# EAGLE board PLC_YN_CPU (EAGLE 9.6.2), part 1 of 2
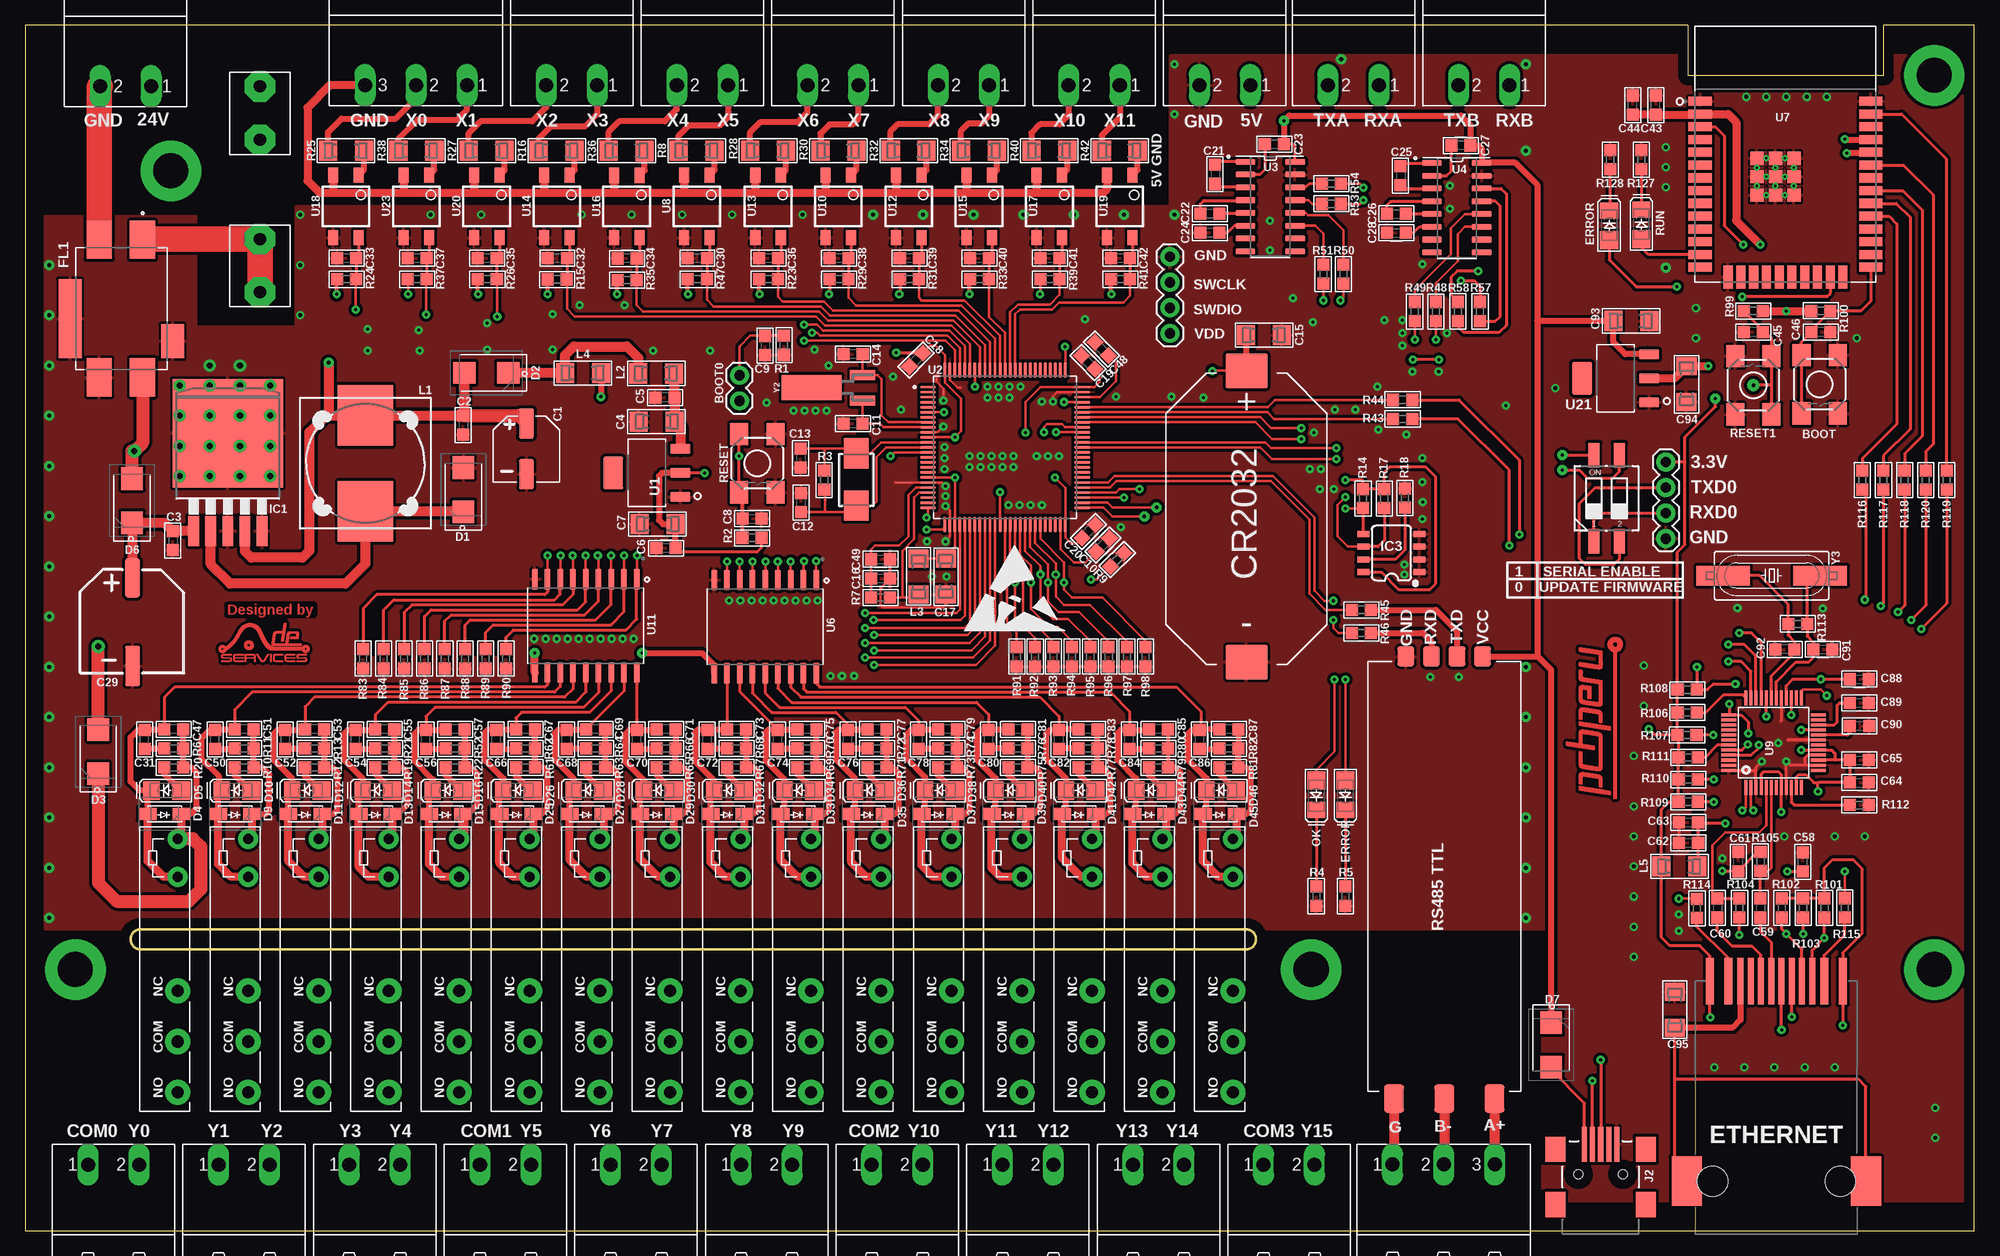
[diagram p8: board, top side]
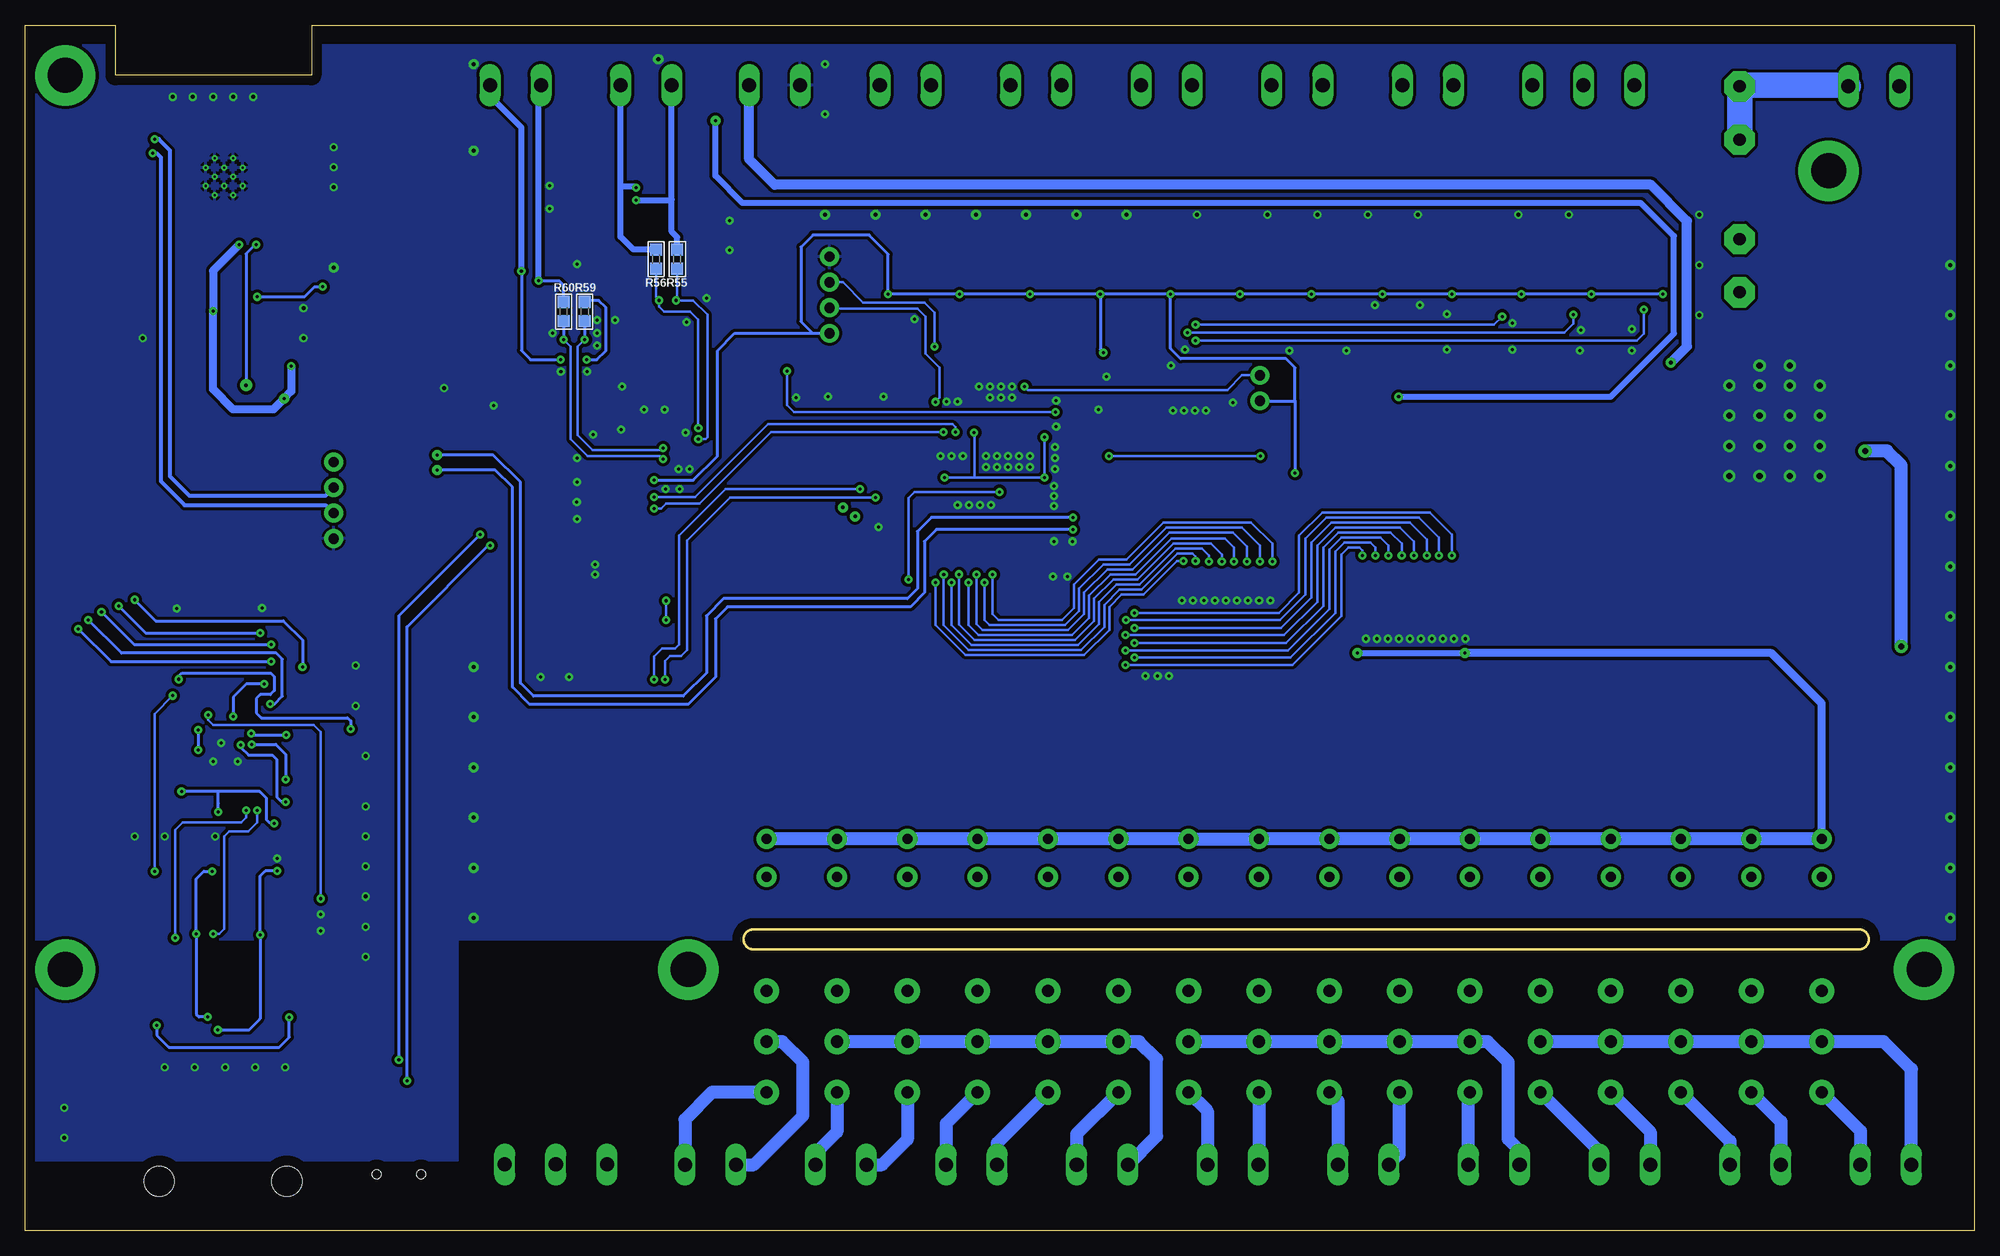
[diagram p9: board, bottom side, seen from below]

Size 194 x 120 mm. Coordinates in mm from the lower left corner, seen from the top.
Outline: 0,0 194,0 194,120 185,120 185,115 165.5,115 165.5,120 0,120 0,0
Outline: 11.5,30 arc90 10.5,29 arc90 11.5,28 121.5,28 arc90 122.5,29 arc90 121.5,30 11.5,30
Copper layers (1*16): Top 0.035mm / dielectric 1.6mm / Bottom 0.035mm
Design rules "Configuración_PCB_ADE *": minimum track width 0.2mm, minimum drill 0.3mm, track to track 0.125mm, track to pad 0.125mm, pad to pad 0.125mm, via to via 0.3mm, smd to smd 0.3mm, copper to edge 1mm, drill to drill 0.3mm, minimum pad ring 0.2mm, minimum via ring 0.125mm, stop-mask expansion 0.15mm, vias tented up to drill 0.3mm, thermal gap 10mil

## Footprints (pad centres in the part's own frame; a part is rotated, then mirrored left to right if it is on the bottom)
SWITCH = smd 2.2 x 1.8: 1 -2.894,1.805; 2 2.894,1.805; 3 -2.894,-1.805; 4 2.894,-1.805
1X02 = drill 1.016 pad 1.88: 1 0,0; 2 2.54,0
BAT_CR2032_SMD = smd 4.2 x 3.5: N 0,-13.76; P 0,15.24
CAP_100UF_6.3X7.7SMD = smd 1.5 x 3: N 0,-2.7; P 0,2.35
C0603 = smd 1.2 x 1.2: 1 -0.95,0; 2 0.95,0
SMD_1206 = smd 1.8 x 2: 1 -1.75,0.01; 2 1.83,0
CAP_470UF_SMD_10X10.2 = smd 1.5 x 4: N 0.1,-4.5; P 0.1,4.3
B360 = smd 2.25 x 2.15: 1 -2.2,0; 2 2.2,0
SOD3716X145N = smd 1.8 x 1.2: 1 -1.7,0; 2 1.7,0
L1206 = smd 1.8 x 1.803: A -1.522,0 | smd 1.6 x 1.803: C 1.422,0
PORTAFUSIBLE = drill 1.2 pad 3 octagon: P$1 -10.16,-0.27; P$2 10.34,-0.27; P$3 -4.86,-0.27; P$4 5.04,-0.27
FIL_BNX022-01L = smd 3.8 x 2.5: 1 -6.85,2.1; 2 6.85,2.1; 3 -6.85,-2.2; 5 6.85,-2.2 | smd 3.4 x 2.3: 4 3.25,5.1 | smd 7.9 x 2.3: 6 1,-5.1
TO263-5 = smd 1.067 x 3: 1 -3.404,-6.091; 2 -1.702,-6.091; 3 0,-6.091; 4 1.702,-6.091; 5 3.404,-6.091 | smd 11 x 10.8: 6 0,3.64
SO08 = smd 0.6 x 1.2: 1 -1.905,-2.8; 2 -0.635,-2.8; 3 0.635,-2.8; 4 1.905,-2.8; 5 1.905,2.8; 6 0.635,2.8; 7 -0.635,2.8; 8 -1.905,2.8
1X04 = drill 1.016 pad 1.88: 1 0,0; 2 2.54,0; 3 5.08,0; 4 7.62,0
USB-MINIB = smd 3.5 x 0.5: D+ 3,0; D- 3,0.8; GND 3,-1.6; ID 3,-0.8; VBUS 3,1.6 | smd 2.5 x 2: S1 -3,4.5; S2 2.5,4.5; S3 -3,-4.5; S4 2.5,-4.5 | hole 0.9: 0,2.2; 0,-2.2
IND = smd 6 x 5.5: 1 -4.775,0; 2 4.775,0
R0603 = smd 1.2 x 1.2: 1 -0.95,0; 2 0.95,0
HF41F = drill 1 pad 2: 1 -10.1,1.4; 2 -6.32,1.4 | drill 1.2 pad 2.5: 3 5.04,1.4; 4 10.08,1.4; 5 15.12,1.4
CTS-219-02 = smd 1.13 x 2.44: 1 -1.27,-4.3; 2 1.27,-4.3; 3 1.27,4.3; 4 -1.27,4.3
SOT229P700X180-4N = smd 1 x 2: 1 -2.39,-3.345; 2 0,-3.345; 3 2.39,-3.345 | smd 3.24 x 2: 4 0,3.345
QFP50P1600X1600X160-100N = smd 1.56 x 0.28: 1 -7.68,6; 2 -7.68,5.5; 3 -7.68,5; 4 -7.68,4.5; 5 -7.68,4; 6 -7.68,3.5; 7 -7.68,3; 8 -7.68,2.5; 9 -7.68,2; 10 -7.68,1.5; 11 -7.68,1; 12 -7.68,0.5; 13 -7.68,0; 14 -7.68,-0.5; 15 -7.68,-1; 16 -7.68,-1.5; 17 -7.68,-2; 18 -7.68,-2.5; 19 -7.68,-3; 20 -7.68,-3.5; 21 -7.68,-4; 22 -7.68,-4.5; 23 -7.68,-5; 24 -7.68,-5.5; 25 -7.68,-6; 51 7.68,-6; 52 7.68,-5.5; 53 7.68,-5; 54 7.68,-4.5; 55 7.68,-4; 56 7.68,-3.5; 57 7.68,-3; 58 7.68,-2.5; 59 7.68,-2; 60 7.68,-1.5; 61 7.68,-1; 62 7.68,-0.5; 63 7.68,0; 64 7.68,0.5; 65 7.68,1; 66 7.68,1.5; 67 7.68,2; 68 7.68,2.5; 69 7.68,3; 70 7.68,3.5; 71 7.68,4; 72 7.68,4.5; 73 7.68,5; 74 7.68,5.5; 75 7.68,6 | smd 0.28 x 1.56: 26 -6,-7.68; 27 -5.5,-7.68; 28 -5,-7.68; 29 -4.5,-7.68; 30 -4,-7.68; 31 -3.5,-7.68; 32 -3,-7.68; 33 -2.5,-7.68; 34 -2,-7.68; 35 -1.5,-7.68; 36 -1,-7.68; 37 -0.5,-7.68; 38 0,-7.68; 39 0.5,-7.68; 40 1,-7.68; 41 1.5,-7.68; 42 2,-7.68; 43 2.5,-7.68; 44 3,-7.68; 45 3.5,-7.68; 46 4,-7.68; 47 4.5,-7.68; 48 5,-7.68; 49 5.5,-7.68; 50 6,-7.68; 76 6,7.68; 77 5.5,7.68; 78 5,7.68; 79 4.5,7.68; 80 4,7.68; 81 3.5,7.68; 82 3,7.68; 83 2.5,7.68; 84 2,7.68; 85 1.5,7.68; 86 1,7.68; 87 0.5,7.68; 88 0,7.68; 89 -0.5,7.68; 90 -1,7.68; 91 -1.5,7.68; 92 -2,7.68; 93 -2.5,7.68; 94 -3,7.68; 95 -3.5,7.68; 96 -4,7.68; 97 -4.5,7.68; 98 -5,7.68; 99 -5.5,7.68; 100 -6,7.68
SOIC127P600X175-16N = smd 1.97 x 0.6: 1 -2.475,4.445; 2 -2.475,3.175; 3 -2.475,1.905; 4 -2.475,0.635; 5 -2.475,-0.635; 6 -2.475,-1.905; 7 -2.475,-3.175; 8 -2.475,-4.445; 9 2.475,-4.445; 10 2.475,-3.175; 11 2.475,-1.905; 12 2.475,-0.635; 13 2.475,0.635; 14 2.475,1.905; 15 2.475,3.175; 16 2.475,4.445
RS485TTL = smd 2.8 x 2: A+ 21.9,4.2; B- 21.9,-0.8; GROUND 21.9,-5.8 | smd 2 x 1.7: GND -22.11,-4.62; RXD -22.11,-2.08; TXD -22.11,0.46; VCC -22.11,3
SOIC127P1030X265-18N = smd 2.06 x 0.6: 1 -4.64,5.08; 2 -4.64,3.81; 3 -4.64,2.54; 4 -4.64,1.27; 5 -4.64,0; 6 -4.64,-1.27; 7 -4.64,-2.54; 8 -4.64,-3.81; 9 -4.64,-5.08; 10 4.64,-5.08; 11 4.64,-3.81; 12 4.64,-2.54; 13 4.64,-1.27; 14 4.64,0; 15 4.64,1.27; 16 4.64,2.54; 17 4.64,3.81; 18 4.64,5.08
MODULE_ESP32-WROOM-32D = smd 2.3 x 0.9: 1 -8.5,5.26; 2 -8.5,3.99; 3 -8.5,2.72; 4 -8.5,1.45; 5 -8.5,0.18; 6 -8.5,-1.09; 7 -8.5,-2.36; 8 -8.5,-3.63; 9 -8.5,-4.9; 10 -8.5,-6.17; 11 -8.5,-7.44; 12 -8.5,-8.71; 13 -8.5,-9.98; 14 -8.5,-11.25; 25 8.5,-11.25; 26 8.5,-9.98; 27 8.5,-8.71; 28 8.5,-7.44; 29 8.5,-6.17; 30 8.5,-4.9; 31 8.5,-3.63; 32 8.5,-2.36; 33 8.5,-1.09; 34 8.5,0.18; 35 8.5,1.45; 36 8.5,2.72; 37 8.5,3.99; 38 8.5,5.26 | smd 0.9 x 2.3: 15 -5.715,-12.25; 16 -4.445,-12.25; 17 -3.175,-12.25; 18 -1.905,-12.25; 19 -0.635,-12.25; 20 0.635,-12.25; 21 1.905,-12.25; 22 3.175,-12.25; 23 4.445,-12.25; 24 5.715,-12.25 | smd 1.33 x 1.33: 39_1 -2.835,-0.405; 39_2 -1,-0.405; 39_3 0.835,-0.405; 39_4 -2.835,-2.24; 39_5 -1,-2.24; 39_6 0.835,-2.24; 39_7 -2.835,-4.075; 39_8 -1,-4.075; 39_9 0.835,-4.075 | drill 0.2 pad 0.3: 39_10 -1.917,-0.405; 39_11 -0.083,-0.405; 39_12 -2.835,-1.323; 39_13 -1,-1.323; 39_14 0.835,-1.323; 39_15 -1.917,-2.24; 39_16 -0.083,-2.24; 39_17 -2.835,-3.158; 39_18 -1,-3.158; 39_19 0.835,-3.158; 39_20 -1.917,-4.075; 39_21 -0.083,-4.075
TLP127 = smd 1.5 x 1: 1 -0.56,3.81; 3 -0.56,1.27; 4 5.64,1.27; 6 5.64,3.81
W5500 = smd 1.5 x 0.3: 1 -4.45,2.75; 2 -4.45,2.25; 3 -4.45,1.75; 4 -4.45,1.25; 5 -4.45,0.75; 6 -4.45,0.25; 7 -4.45,-0.25; 8 -4.45,-0.75; 9 -4.45,-1.25; 10 -4.45,-1.75; 11 -4.45,-2.25; 12 -4.45,-2.75; 25 4.45,-2.75; 26 4.45,-2.25; 27 4.45,-1.75; 28 4.45,-1.25; 29 4.45,-0.75; 30 4.45,-0.25; 31 4.45,0.25; 32 4.45,0.75; 33 4.45,1.25; 34 4.45,1.75; 35 4.45,2.25; 36 4.45,2.75 | smd 0.3 x 1.5: 13 -2.75,-4.45; 14 -2.25,-4.45; 15 -1.75,-4.45; 16 -1.25,-4.45; 17 -0.75,-4.45; 18 -0.25,-4.45; 19 0.25,-4.45; 20 0.75,-4.45; 21 1.25,-4.45; 22 1.75,-4.45; 23 2.25,-4.45; 24 2.75,-4.45; 37 2.75,4.45; 38 2.25,4.45; 39 1.75,4.45; 40 1.25,4.45; 41 0.75,4.45; 42 0.25,4.45; 43 -0.25,4.45; 44 -0.75,4.45; 45 -1.25,4.45; 46 -1.75,4.45; 47 -2.25,4.45; 48 -2.75,4.45
MSTBA2 = drill 1.397 long: 1 -2.54,5.08; 2 2.54,5.08
MSTBA3 = drill 1.397 long: 1 -5.08,5.08; 2 0,5.08; 3 5.08,5.08
HR961160C = smd 3 x 4.9: CSH1 -2.31,19.92; CSH2 15.53,19.92 | smd 0.81 x 4.6: P1 0,0; P2 1.84,0; P11 11.38,0; P12 13.22,0 | smd 0.61 x 4.6: P3 3.04,0.01; P4 4.06,0; P5 5.08,0; P6 6.1,0; P7 7.12,0; P8 8.14,0; P9 9.16,0; P10 10.18,0 | hole 3: 12.96,19.92; 0.26,19.92
CRYSTAL-SMD-5X3.2-2PAD = smd 3 x 2.4: P$1 2.55,0; P$2 -2.65,0
CRYSTAL-SMD-2X6-CYL = smd 2.5 x 6: SHEILD 0,5.08 | smd 1 x 2.5: X1 -1.27,0; X2 1.27,0
HC49UP = smd 5.334 x 1.93: 1 -4.826,0; 2 4.826,0

## Placement (x,y rotation side)
BOOT  TS4548TP  [SWITCH]  178.6,84.25 270 top
BOOT0  [1X02]  71.1,82.6 90 top
BT1  CR2032-BS-6-1  [BAT_CR2032_SMD]  121.56,70.35 0 top
C1  RVT1E221M0607  [CAP_100UF_6.3X7.7SMD]  49.9,78 0 top
C2  100nF  [C0603]  43.6,80.2 270 top
C3  100nF  [C0603]  14.7,68.7 270 top
C4  22uF  [SMD_1206]  62.87,80.53 180 top
C5  100nF  [C0603]  63.67,82.93 180 top
C6  100nF  [C0603]  63.77,67.93 180 top
C7  22uF  [SMD_1206]  62.97,70.33 180 top
C8  100nF  [C0603]  72.34,70.87 0 top
C9  100nF  [C0603]  73.64,88.12 270 top
C10  2.2uF  [C0603]  107.27,68.25 45 top
C11  10pF  [C0603]  82.41,80.33 180 top
C12  20pF  [C0603]  77.23,72.49 90 top
C13  20pF  [C0603]  77.19,76.92 270 top
C14  10pF  [C0603]  82.42,87.25 180 top
C15  1uF  [SMD_1206]  123.27,89.12 0 top
C16  100nF  [C0603]  85.15,64.93 0 top
C17  T491A105M035AT  [SMD_1206]  91.63,65.14 270 top
C18  100nF  [C0603]  88.67,86.68 225 top
C19  100nF  [C0603]  105.79,86.43 135 top
C20  100nF  [C0603]  105.84,69.61 45 top
C21  1uF  [C0603]  118.42,105.14 270 top
C22  1uF  [C0603]  117.92,101.24 0 top
C23  1uF  [C0603]  124.32,108.14 180 top
C24  1uF  [C0603]  117.92,99.34 0 top
C25  1uF  [C0603]  136.89,105.02 270 top
C26  1uF  [C0603]  136.49,101.22 0 top
C27  1uF  [C0603]  142.89,108.02 180 top
C28  1uF  [C0603]  136.49,99.32 0 top
C29  RVT1V471M1010  [CAP_470UF_SMD_10X10.2]  10.6,60.7 0 top
C30  100nF  [C0603]  66.9,96.8 180 top
C31  100nF  [C0603]  11.9,48.9 90 top
C32  100nF  [C0603]  52.97,96.79 180 top
C33  100nF  [C0603]  32,96.8 180 top
C34  100nF  [C0603]  59.93,96.78 180 top
C35  100nF  [C0603]  46,96.8 180 top
C36  100nF  [C0603]  74,96.8 180 top
C37  100nF  [C0603]  39,96.8 180 top
C38  100nF  [C0603]  81,96.8 180 top
C39  100nF  [C0603]  88,96.8 180 top
C40  100nF  [C0603]  95,96.8 180 top
C41  100nF  [C0603]  102,96.8 180 top
C42  100nF  [C0603]  109,96.8 180 top
C43  22uF  [C0603]  162.3,112.05 90 top
C44  100nF  [C0603]  160,112.05 90 top
C45  100nF  [C0603]  172,89.45 180 top
C46  100nF  [C0603]  178.7,89.45 180 top
C47  100pF  [C0603]  14.8,49.9 180 top
C48  2.2uF  [C0603]  107.13,87.77 135 top
C49  1uF  [C0603]  85.15,66.83 0 top
C50  100nF  [C0603]  18.9,48.9 90 top
C51  100pF  [C0603]  21.8,49.9 180 top
C52  100nF  [C0603]  25.9,48.9 90 top
C53  100pF  [C0603]  28.8,49.9 180 top
C54  100nF  [C0603]  32.9,48.9 90 top
C55  100pF  [C0603]  35.8,49.9 180 top
C56  100nF  [C0603]  39.9,48.9 90 top
C57  100pF  [C0603]  42.8,49.9 180 top
C58  22pF  [C0603]  176.93,36.72 90 top
C59  6.8nF  [C0603]  172.71,32.11 270 top
C60  6.8nF  [C0603]  168.43,32.11 270 top
C61  10nF  [C0603]  170.51,36.73 90 top
C62  100nF  [C0603]  165.55,38.6 180 top
C63  100nF  [C0603]  165.55,40.63 180 top
C64  100nF  [C0603]  182.56,44.6 0 top
C65  4.7uF  [C0603]  182.56,46.84 0 top
C66  100nF  [C0603]  46.9,48.9 90 top
C67  100pF  [C0603]  49.8,49.9 180 top
C68  100nF  [C0603]  53.9,48.9 90 top
C69  100pF  [C0603]  56.8,49.9 180 top
C70  100nF  [C0603]  60.9,48.9 90 top
C71  100pF  [C0603]  63.8,49.9 180 top
C72  100nF  [C0603]  67.9,48.9 90 top
C73  100pF  [C0603]  70.8,49.9 180 top
C74  100nF  [C0603]  74.9,48.9 90 top
C75  100pF  [C0603]  77.8,49.9 180 top
C76  100nF  [C0603]  81.9,48.9 90 top
C77  100pF  [C0603]  84.8,49.9 180 top
C78  100nF  [C0603]  88.9,48.9 90 top
C79  100pF  [C0603]  91.8,49.9 180 top
C80  100nF  [C0603]  95.9,48.9 90 top
C81  100pF  [C0603]  98.8,49.9 180 top
C82  100nF  [C0603]  102.9,48.9 90 top
C83  100pF  [C0603]  105.8,49.9 180 top
C84  100nF  [C0603]  109.9,48.9 90 top
C85  100pF  [C0603]  112.8,49.9 180 top
C86  100nF  [C0603]  116.9,48.9 90 top
C87  100pF  [C0603]  119.8,49.9 180 top
C88  100nF  [C0603]  182.55,54.89 0 top
C89  10nF  [C0603]  182.56,52.53 0 top
C90  4.7uF  [C0603]  182.57,50.24 0 top
C91  18pF  [C0603]  178.92,57.87 0 top
C92  18pF  [C0603]  175.12,57.87 180 top
C93  10uF  [SMD_1206]  159.8,90.55 0 top
C94  10uF  [SMD_1206]  165.35,84.29 270 top
C95  1nF 2Kv  [SMD_1206]  164.2,21.95 90 top
D1  SS36F  [B360]  43.62,73.76 90 top
D2  SS36F  [B360]  45.9,85.39 180 top
D3  SS56  [B360]  7.28,47.68 90 top
D4  1N4148W-13-F  [SOD3716X145N]  13.9,41.5 180 top
D5  XL-3216UBC  [L1206]  14,43.8 180 top
D6  SS56  [B360]  10.64,72.66 90 top
D7  SS36F  [B360]  151.88,18.5 270 top
D9  1N4148W-13-F  [SOD3716X145N]  20.9,41.5 180 top
D10  XL-3216UBC  [L1206]  21,43.8 180 top
D11  1N4148W-13-F  [SOD3716X145N]  27.9,41.5 180 top
D12  XL-3216UBC  [L1206]  28,43.8 180 top
D13  1N4148W-13-F  [SOD3716X145N]  34.9,41.5 180 top
D14  XL-3216UBC  [L1206]  35,43.8 180 top
D15  1N4148W-13-F  [SOD3716X145N]  41.9,41.5 180 top
D16  XL-3216UBC  [L1206]  42,43.8 180 top
D25  1N4148W-13-F  [SOD3716X145N]  48.9,41.5 180 top
D26  XL-3216UBC  [L1206]  49,43.8 180 top
D27  1N4148W-13-F  [SOD3716X145N]  55.9,41.5 180 top
D28  XL-3216UBC  [L1206]  56,43.8 180 top
D29  1N4148W-13-F  [SOD3716X145N]  62.9,41.5 180 top
D30  XL-3216UBC  [L1206]  63,43.8 180 top
D31  1N4148W-13-F  [SOD3716X145N]  69.9,41.5 180 top
D32  XL-3216UBC  [L1206]  70,43.8 180 top
D33  1N4148W-13-F  [SOD3716X145N]  76.9,41.5 180 top
D34  XL-3216UBC  [L1206]  77,43.8 180 top
D35  1N4148W-13-F  [SOD3716X145N]  83.9,41.5 180 top
D36  XL-3216UBC  [L1206]  84,43.8 180 top
D37  1N4148W-13-F  [SOD3716X145N]  90.9,41.5 180 top
D38  XL-3216UBC  [L1206]  91,43.8 180 top
D39  1N4148W-13-F  [SOD3716X145N]  97.9,41.5 180 top
D40  XL-3216UBC  [L1206]  98,43.8 180 top
D41  1N4148W-13-F  [SOD3716X145N]  104.9,41.5 180 top
D42  XL-3216UBC  [L1206]  105,43.8 180 top
D43  1N4148W-13-F  [SOD3716X145N]  111.9,41.5 180 top
D44  XL-3216UBC  [L1206]  112,43.8 180 top
D45  1N4148W-13-F  [SOD3716X145N]  118.9,41.5 180 top
D46  XL-3216UBC  [L1206]  119,43.8 180 top
ERROR  TJ-S3216SW9TGLC2R-A5  [L1206]  131.4,43.3 270 top
ES  [ESD_10.00]  93.4,59.6 0 top
F2  3A  [PORTAFUSIBLE]  23.1,103.56 90 top
FL1  BNX022-01L  [FIL_BNX022-01L]  9.58,91.78 270 top
IC1  LM2596GR-5.0  [TO263-5]  20.18,75.74 0 top
IC3  CAT24C256WI-GT3  [SO08]  135.98,67.45 90 top
J1  [1X04]  113.94,89.32 90 top
J2  920-462A2021S10108  [USB-MINIB]  156.8,5.6 90 top
J3  [1X04]  163.3,76.5 270 top
L1  SMDRI127-470MT  [IND]  33.86,76.38 90 top
L2  CBG321609U121T  [SMD_1206]  62.77,85.33 0 top
L3  CBG321609U121T  [SMD_1206]  88.91,65.08 90 top
L4  ACMS321609A6003A  [SMD_1206]  55.48,85.37 0 top
L5  CBG321609U121T  [SMD_1206]  164.61,36.25 0 top
LED1  LED GREEN  [L1206]  160.85,100.2 90 top
LED2  LED RED  [L1206]  157.65,100.1 90 top
OK  NCD1206G1  [L1206]  128.5,43.3 270 top
R1  10K  [R0603]  75.51,88.13 90 top
R2  10K  [R0603]  72.33,68.97 0 top
R3  1M  [R0603]  79.54,74.71 270 top
R4  1K  [R0603]  128.5,33.3 270 top
R5  1K  [R0603]  131.4,33.3 270 top
R6  100R  [R0603]  14.8,48 0 top
R7  47R  [R0603]  85.15,63.03 180 top
R8  20K  [SMD_1206]  66.8,107.5 0 top
R9  10K  [R0603]  108.7,66.8 225 top
R10  10K  [R0603]  21.8,46.1 0 top
R11  100R  [R0603]  21.8,48 0 top
R12  10K  [R0603]  28.8,46.1 0 top
R13  100R  [R0603]  28.8,48 0 top
R14  10K  [R0603]  133.16,72.89 90 top
R15  10K  [R0603]  52.96,94.69 0 top
R16  20K  [SMD_1206]  52.87,107.49 0 top
R17  10K  [R0603]  135.26,72.88 90 top
R18  1K  [R0603]  137.32,72.92 90 top
R19  10K  [R0603]  35.8,46.1 0 top
R20  10K  [R0603]  14.8,46.1 0 top
R21  100R  [R0603]  35.8,48 0 top
R22  10K  [R0603]  42.8,46.1 0 top
R23  10K  [R0603]  74,94.7 0 top
R24  10K  [R0603]  32,94.7 0 top
R25  20K  [SMD_1206]  31.9,107.5 0 top
R26  10K  [R0603]  46,94.7 0 top
R27  20K  [SMD_1206]  45.9,107.5 0 top
R28  20K  [SMD_1206]  73.9,107.5 0 top
R29  10K  [R0603]  81,94.7 0 top
R30  20K  [SMD_1206]  80.9,107.5 0 top
R31  10K  [R0603]  88,94.7 0 top
R32  20K  [SMD_1206]  87.9,107.5 0 top
R33  10K  [R0603]  95,94.7 0 top
R34  20K  [SMD_1206]  94.9,107.5 0 top
R35  10K  [R0603]  59.92,94.63 0 top
R36  20K  [SMD_1206]  59.83,107.48 0 top
R37  10K  [R0603]  39,94.7 0 top
R38  20K  [SMD_1206]  38.9,107.5 0 top
R39  10K  [R0603]  102,94.7 0 top
R40  20K  [SMD_1206]  101.9,107.5 0 top
R41  10K  [R0603]  109,94.7 0 top
R42  20K  [SMD_1206]  108.9,107.5 0 top
R43  22R  [R0603]  137.1,80.8 180 top
R44  22R  [R0603]  137.1,82.7 180 top
R45  0R  [R0603]  133,61.8 0 top
R46  0R  [R0603]  133,59.5 0 top
R47  10K  [R0603]  66.9,94.7 0 top
R48  0R  [R0603]  140.4,91.5 270 top
R49  0R  [R0603]  138.3,91.5 270 top
R50  0R  [R0603]  131.2,95.2 270 top
R51  0R  [R0603]  129.2,95.2 270 top
R52  100R  [R0603]  42.8,48 0 top
R53  0R  [R0603]  130,102.2 180 top
R54  0R  [R0603]  130,104.2 180 top
R55  0R  [R0603]  129.1,96.7 90 bottom
R56  0R  [R0603]  131.2,96.7 90 bottom
R57  0R  [R0603]  144.8,91.5 90 top
R58  0R  [R0603]  142.6,91.5 90 top
R59  0R  [R0603]  138.3,91.5 270 bottom
R60  0R  [R0603]  140.4,91.5 270 bottom
R61  10K  [R0603]  49.8,46.1 0 top
R62  100R  [R0603]  49.8,48 0 top
R63  10K  [R0603]  56.8,46.1 0 top
R64  100R  [R0603]  56.8,48 0 top
R65  10K  [R0603]  63.8,46.1 0 top
R66  100R  [R0603]  63.8,48 0 top
R67  10K  [R0603]  70.8,46.1 0 top
R68  100R  [R0603]  70.8,48 0 top
R69  10K  [R0603]  77.8,46.1 0 top
R70  100R  [R0603]  77.8,48 0 top
R71  10K  [R0603]  84.8,46.1 0 top
R72  100R  [R0603]  84.8,48 0 top
R73  10K  [R0603]  91.8,46.1 0 top
R74  100R  [R0603]  91.8,48 0 top
R75  10K  [R0603]  98.8,46.1 0 top
R76  100R  [R0603]  98.8,48 0 top
R77  10K  [R0603]  105.8,46.1 0 top
R78  100R  [R0603]  105.8,48 0 top
R79  10K  [R0603]  112.8,46.1 0 top
R80  100R  [R0603]  112.8,48 0 top
R81  10K  [R0603]  119.8,46.1 0 top
R82  100R  [R0603]  119.8,48 0 top
R83  20K  [R0603]  33.65,56.93 90 top
R84  20K  [R0603]  35.68,56.93 90 top
R85  20K  [R0603]  37.71,56.93 90 top
R86  20K  [R0603]  39.74,56.93 90 top
R87  20K  [R0603]  41.77,56.93 90 top
R88  20K  [R0603]  43.8,56.93 90 top
R89  20K  [R0603]  45.83,56.93 90 top
R90  20K  [R0603]  47.86,56.93 90 top
R91  20K  [R0603]  98.69,57.13 90 top
R92  20K  [R0603]  100.52,57.13 90 top
R93  20K  [R0603]  102.35,57.13 90 top
R94  20K  [R0603]  104.18,57.13 90 top
R95  20K  [R0603]  106.01,57.13 90 top
R96  20K  [R0603]  107.84,57.13 90 top
R97  20K  [R0603]  109.67,57.13 90 top
R98  20K  [R0603]  111.5,57.13 90 top
R99  10K  [R0603]  172,91.55 0 top
R100  10K  [R0603]  178.7,91.55 180 top
R101  49.9R  [R0603]  179.08,32.11 90 top
R102  49.9R  [R0603]  174.82,32.11 90 top
R103  10R  [R0603]  176.95,32.11 90 top
R104  49.9R  [R0603]  170.62,32.12 90 top
R105  49.9R  [R0603]  172.72,36.74 270 top
R106  10K  [R0603]  165.41,51.59 0 top
R107  10K  [R0603]  165.4,49.34 0 top
R108  10K  [R0603]  165.41,53.85 0 top
R109  10K  [R0603]  165.51,42.7 0 top
R110  10K  [R0603]  165.51,44.9 0 top
R111  10K  [R0603]  165.51,47.1 0 top
R112  12.4K  [R0603]  182.56,42.36 180 top
R113  1M  [R0603]  176.42,60.4 180 top
R114  330R  [R0603]  166.39,32.09 90 top
R115  330R  [R0603]  181.1,32.15 90 top
R116  0R  [R0603]  182.85,74.7 90 top
R117  0R  [R0603]  184.95,74.7 90 top
R118  0R  [R0603]  187.05,74.7 90 top
R119  0R  [R0603]  191.25,74.7 90 top
R120  0R  [R0603]  189.15,74.7 90 top
R127  0R  [R0603]  160.85,106.6 90 top
R128  0R  [R0603]  157.75,106.6 90 top
RESET  TS4548TP  [SWITCH]  72.87,76.39 270 top
RESET1  TS4548TP  [SWITCH]  172,84.15 90 top
RL1  HF41F  [HF41F]  13.8,28.9 270 top
RL3  HF41F  [HF41F]  20.8,28.9 270 top
RL4  HF41F  [HF41F]  27.8,28.9 270 top
RL5  HF41F  [HF41F]  34.8,28.9 270 top
RL6  HF41F  [HF41F]  41.8,28.9 270 top
RL11  HF41F  [HF41F]  48.8,28.9 270 top
RL12  HF41F  [HF41F]  55.8,28.9 270 top
RL13  HF41F  [HF41F]  62.8,28.9 270 top
RL14  HF41F  [HF41F]  69.8,28.9 270 top
RL15  HF41F  [HF41F]  76.8,28.9 270 top
RL16  HF41F  [HF41F]  83.8,28.9 270 top
RL17  HF41F  [HF41F]  90.8,28.9 270 top
RL18  HF41F  [HF41F]  97.8,28.9 270 top
RL19  HF41F  [HF41F]  104.8,28.9 270 top
RL20  HF41F  [HF41F]  111.8,28.9 270 top
RL21  HF41F  [HF41F]  118.8,28.9 270 top
S2  HAD-02LWAG-2  [CTS-219-02]  157.4,72.9 0 top
U1  AMS1117-3.3  [SOT229P700X180-4N]  61.87,75.43 90 top
U2  STM32F407VGT6  [QFP50P1600X1600X160-100N]  97.53,77.97 0 top
U3  MAX232IDR  [SOIC127P600X175-16N]  123.92,101.94 0 top
U4  MAX232IDR  [SOIC127P600X175-16N]  142.49,101.82 0 top
U5  RS485  [RS485TTL]  142.04,35.05 270 top
U6  ULN2803ADWR  [SOIC127P1030X265-18N]  73.66,60.13 270 top
U7  ESP32-WROOM-32U  [MODULE_ESP32-WROOM-32D]  175.2,107.15 0 top
U8  LTV-357T-B-IN  [TLP127]  64.3,104.5 270 top
U9  W5500  [W5500]  174.02,48.58 90 top
U10  LTV-357T-B-IN  [TLP127]  78.4,104.5 270 top
U11  ULN2803ADWR  [SOIC127P1030X265-18N]  55.8,60.2 270 top
U12  LTV-357T-B-IN  [TLP127]  85.4,104.5 270 top
U13  LTV-357T-B-IN  [TLP127]  71.4,104.5 270 top
U14  LTV-357T-B-IN  [TLP127]  50.37,104.49 270 top
U15  LTV-357T-B-IN  [TLP127]  92.4,104.5 270 top
U16  LTV-357T-B-IN  [TLP127]  57.33,104.48 270 top
U17  LTV-357T-B-IN  [TLP127]  99.4,104.5 270 top
U18  LTV-357T-B-IN  [TLP127]  29.4,104.5 270 top
U19  LTV-357T-B-IN  [TLP127]  106.4,104.5 270 top
U20  LTV-357T-B-IN  [TLP127]  43.4,104.5 270 top
U21  AMS1117-3.3  [SOT229P700X180-4N]  158.3,84.85 90 top
U23  LTV-357T-B-IN  [TLP127]  36.4,104.5 270 top
U$2  [PCB_PERU]  159,43 90 top
U$3  [ADE2021]  19,56 0 top
X1  MSTBA2  [MSTBA2]  10,119 180 top
X2  MSTBA2  [MSTBA2]  119.4,119.1 180 top
X3  MSTBA3  [MSTBA3]  141.18,1.51 0 top
X4  HR961160C  [HR961160C]  180.9,24.85 180 top
X5  MSTBA2  [MSTBA2]  8.8,1.5 0 top
X6  MSTBA2  [MSTBA2]  34.8,1.5 0 top
X7  MSTBA2  [MSTBA2]  47.8,1.5 0 top
X8  MSTBA2  [MSTBA2]  60.8,1.5 0 top
X9  MSTBA2  [MSTBA2]  125.8,1.5 0 top
X10  MSTBA2  [MSTBA2]  21.8,1.5 0 top
X11  MSTBA2  [MSTBA2]  54.4,119.1 180 top
X12  MSTBA2  [MSTBA2]  67.4,119.1 180 top
X13  MSTBA2  [MSTBA2]  80.4,119.1 180 top
X14  MSTBA2  [MSTBA2]  93.4,119.1 180 top
X15  MSTBA2  [MSTBA2]  106.4,119.1 180 top
X17  MSTBA2  [MSTBA2]  132.2,119.1 180 top
X18  MSTBA3  [MSTBA3]  38.9,119.1 180 top
X19  MSTBA2  [MSTBA2]  73.8,1.5 0 top
X20  MSTBA2  [MSTBA2]  86.8,1.5 0 top
X21  MSTBA2  [MSTBA2]  99.8,1.5 0 top
X22  MSTBA2  [MSTBA2]  112.8,1.5 0 top
X23  MSTBA2  [MSTBA2]  145.2,119.1 180 top
Y1  6I08000F20UCG  [CRYSTAL-SMD-5X3.2-2PAD]  82.72,74.73 270 top
Y2  TAXM32768K2BGDAZN2T  [CRYSTAL-SMD-2X6-CYL]  83.36,83.91 90 top
Y3  25MHz  [HC49UP]  173.82,65.2 180 top